# EAGLE schematic EDCPSUMK2_2040 (EAGLE 9.6.2)
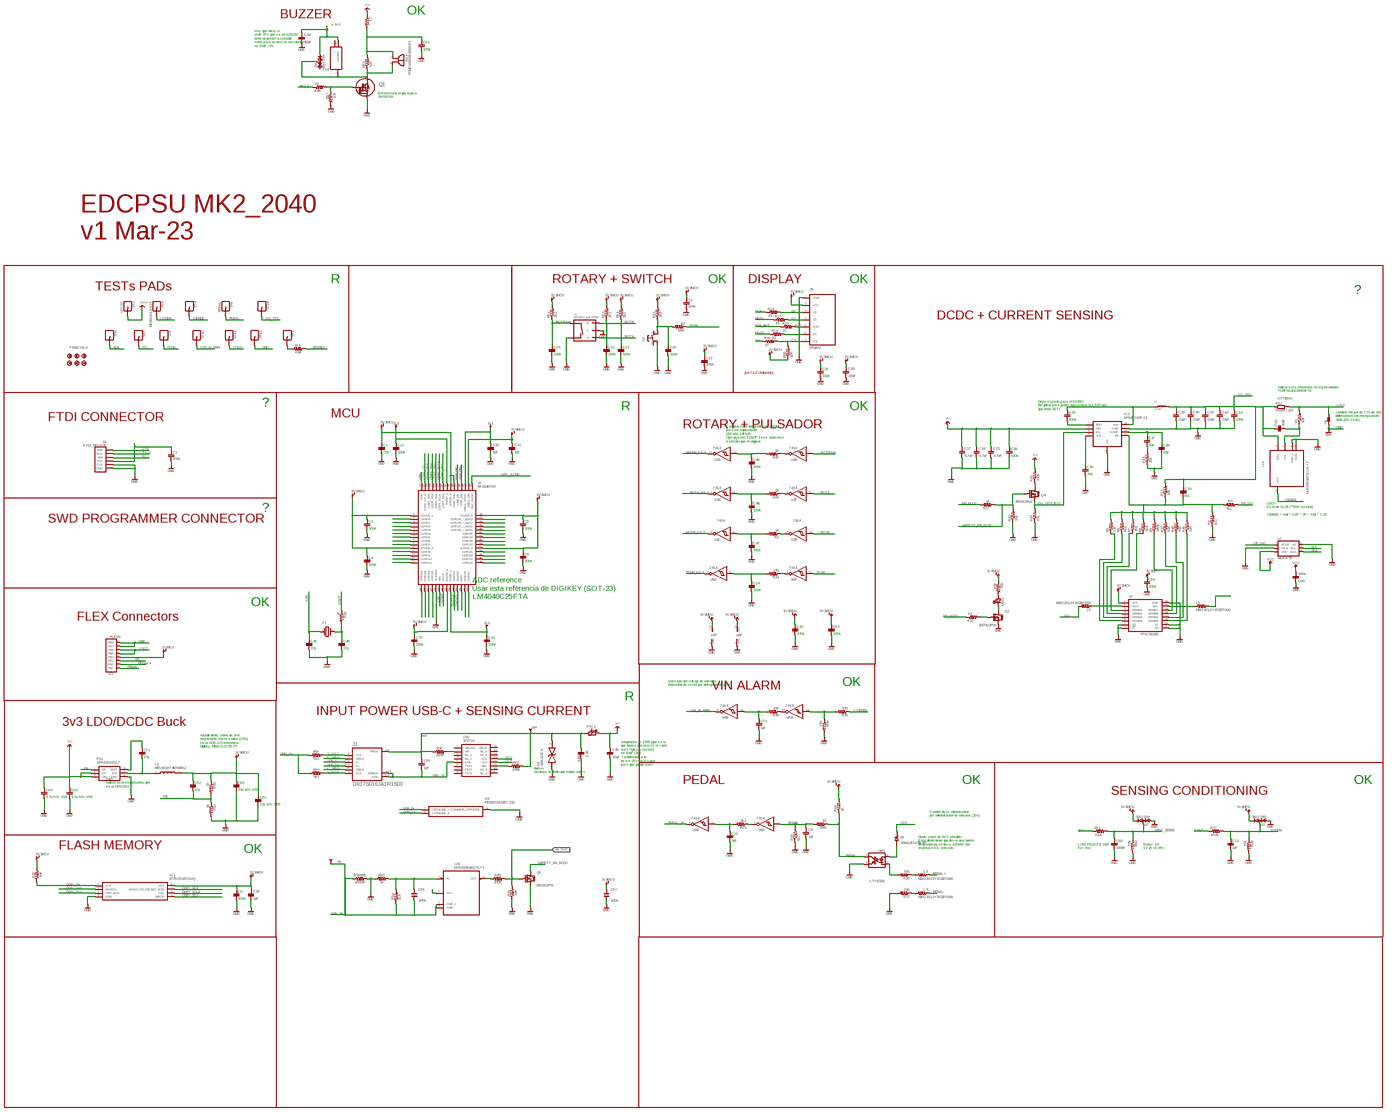
[diagram p0: schematic, sheet 1, overview]
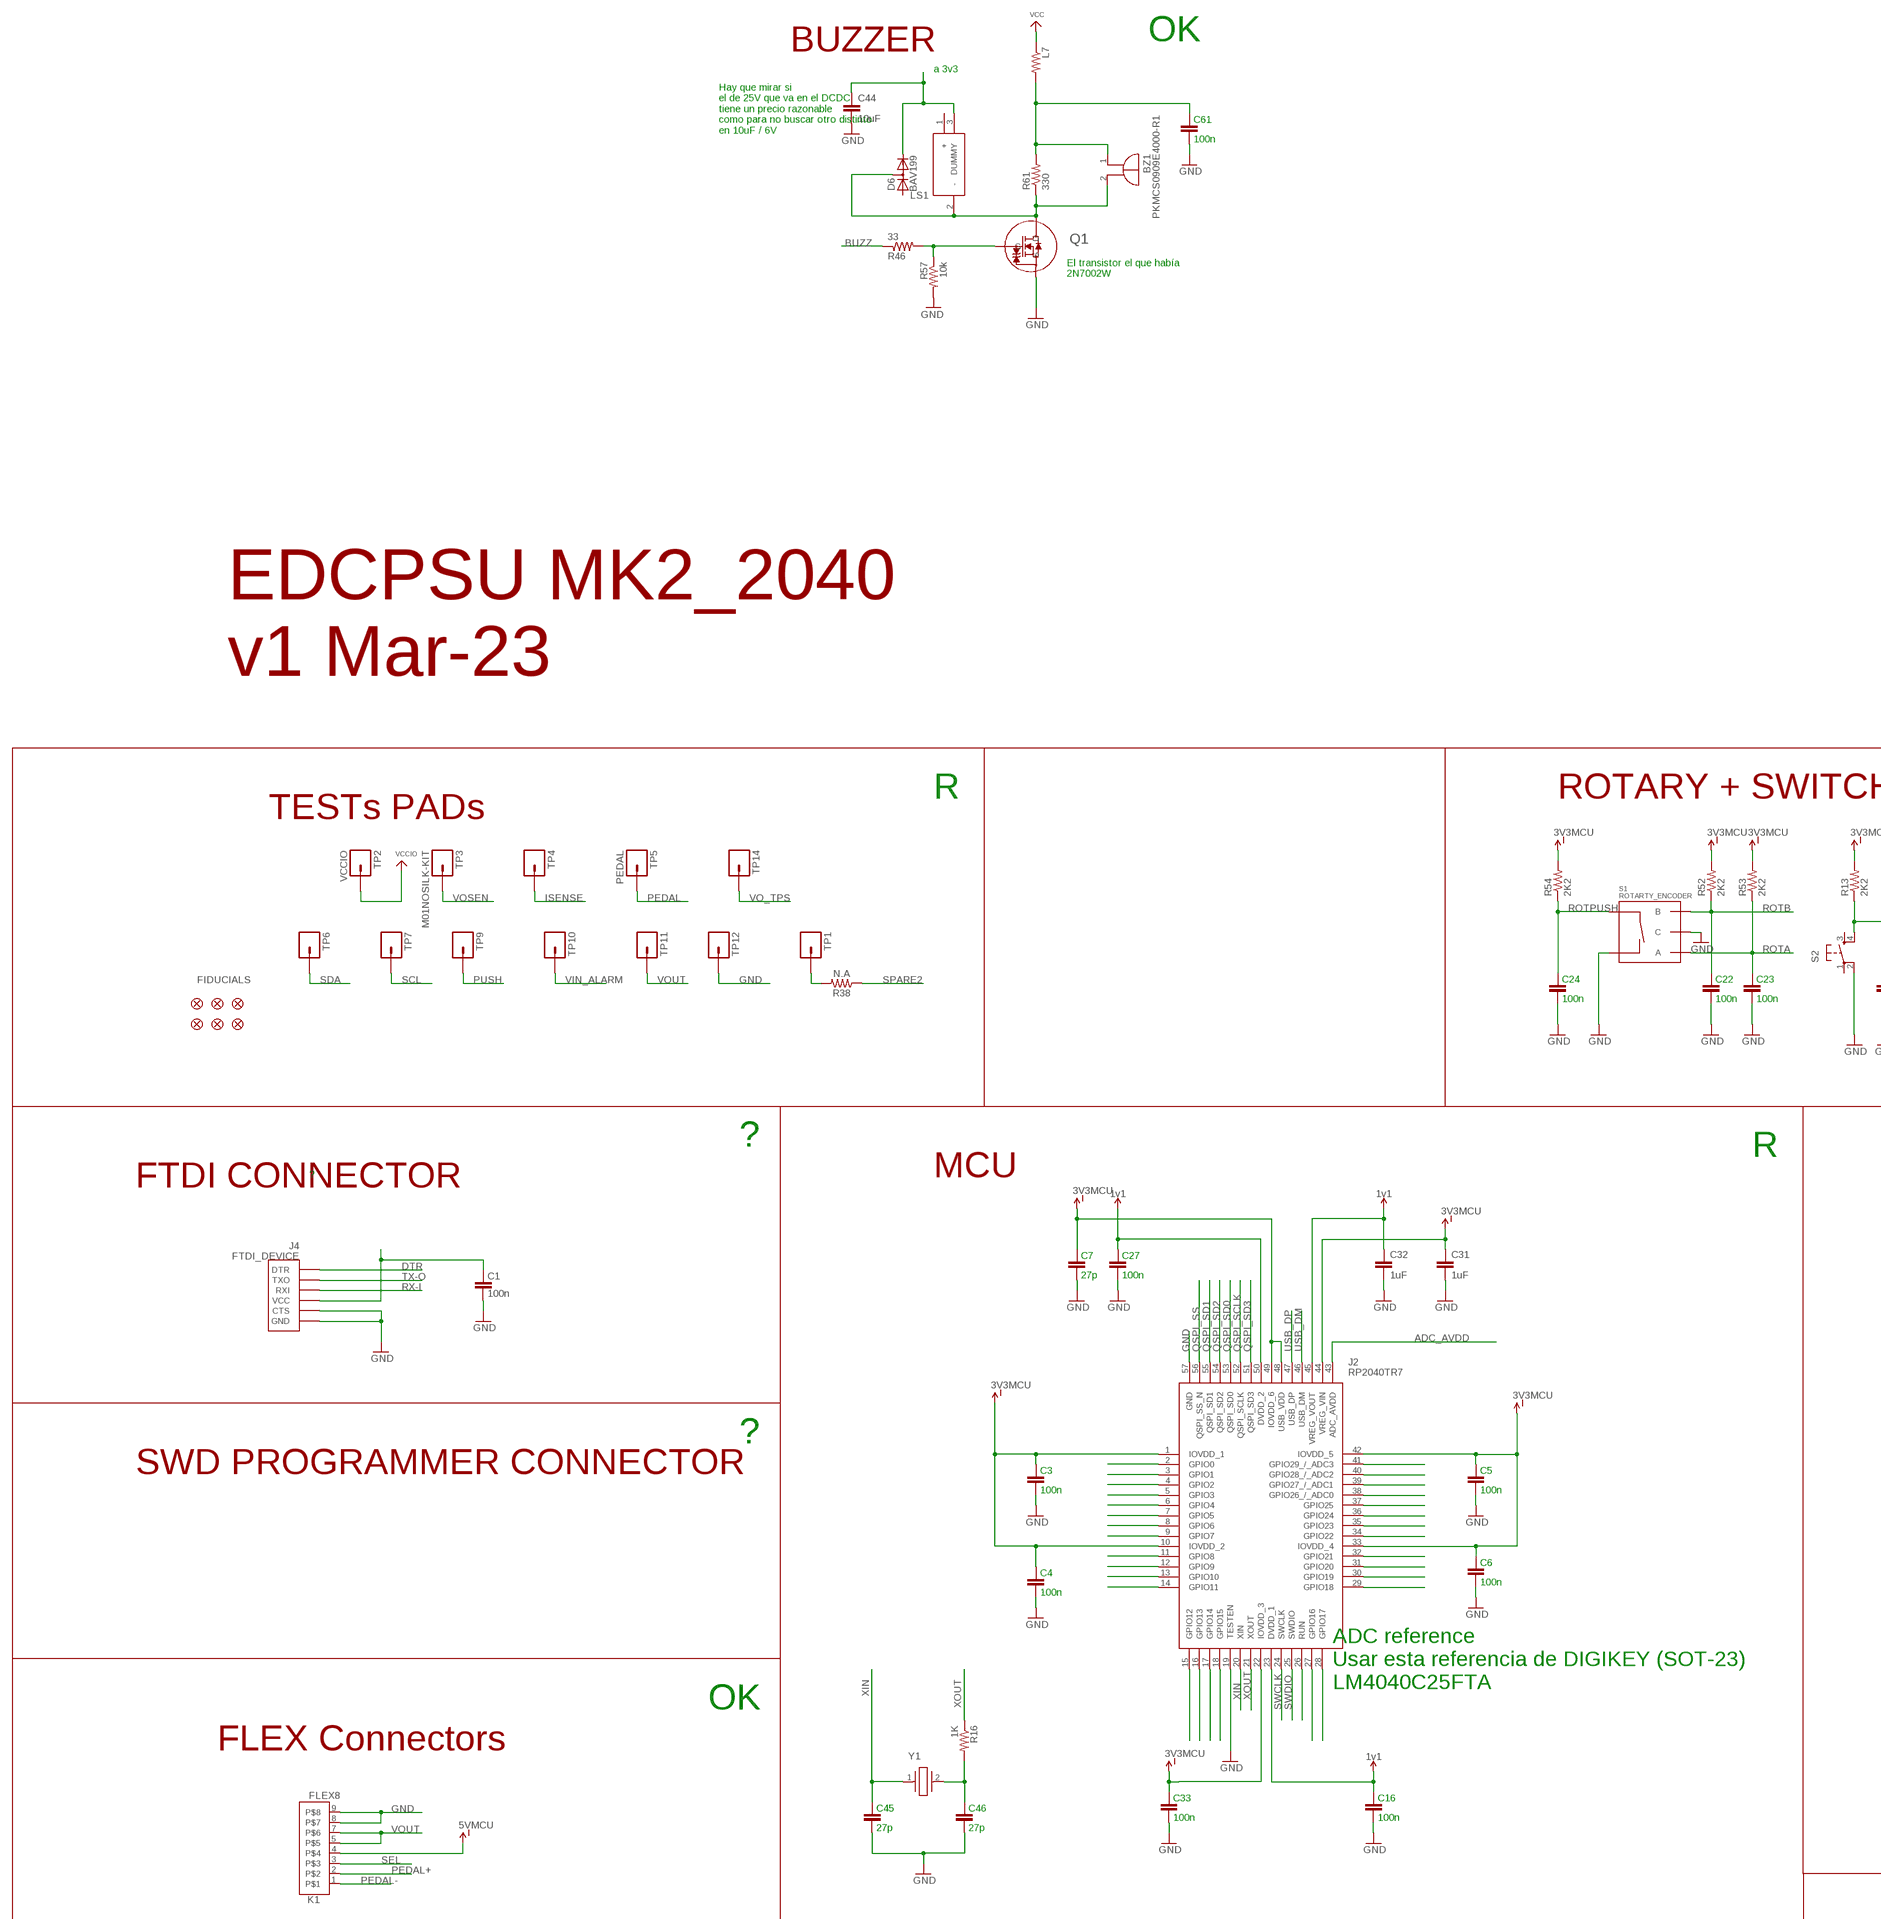
[diagram p1: schematic, sheet 1, part 1 of 4]
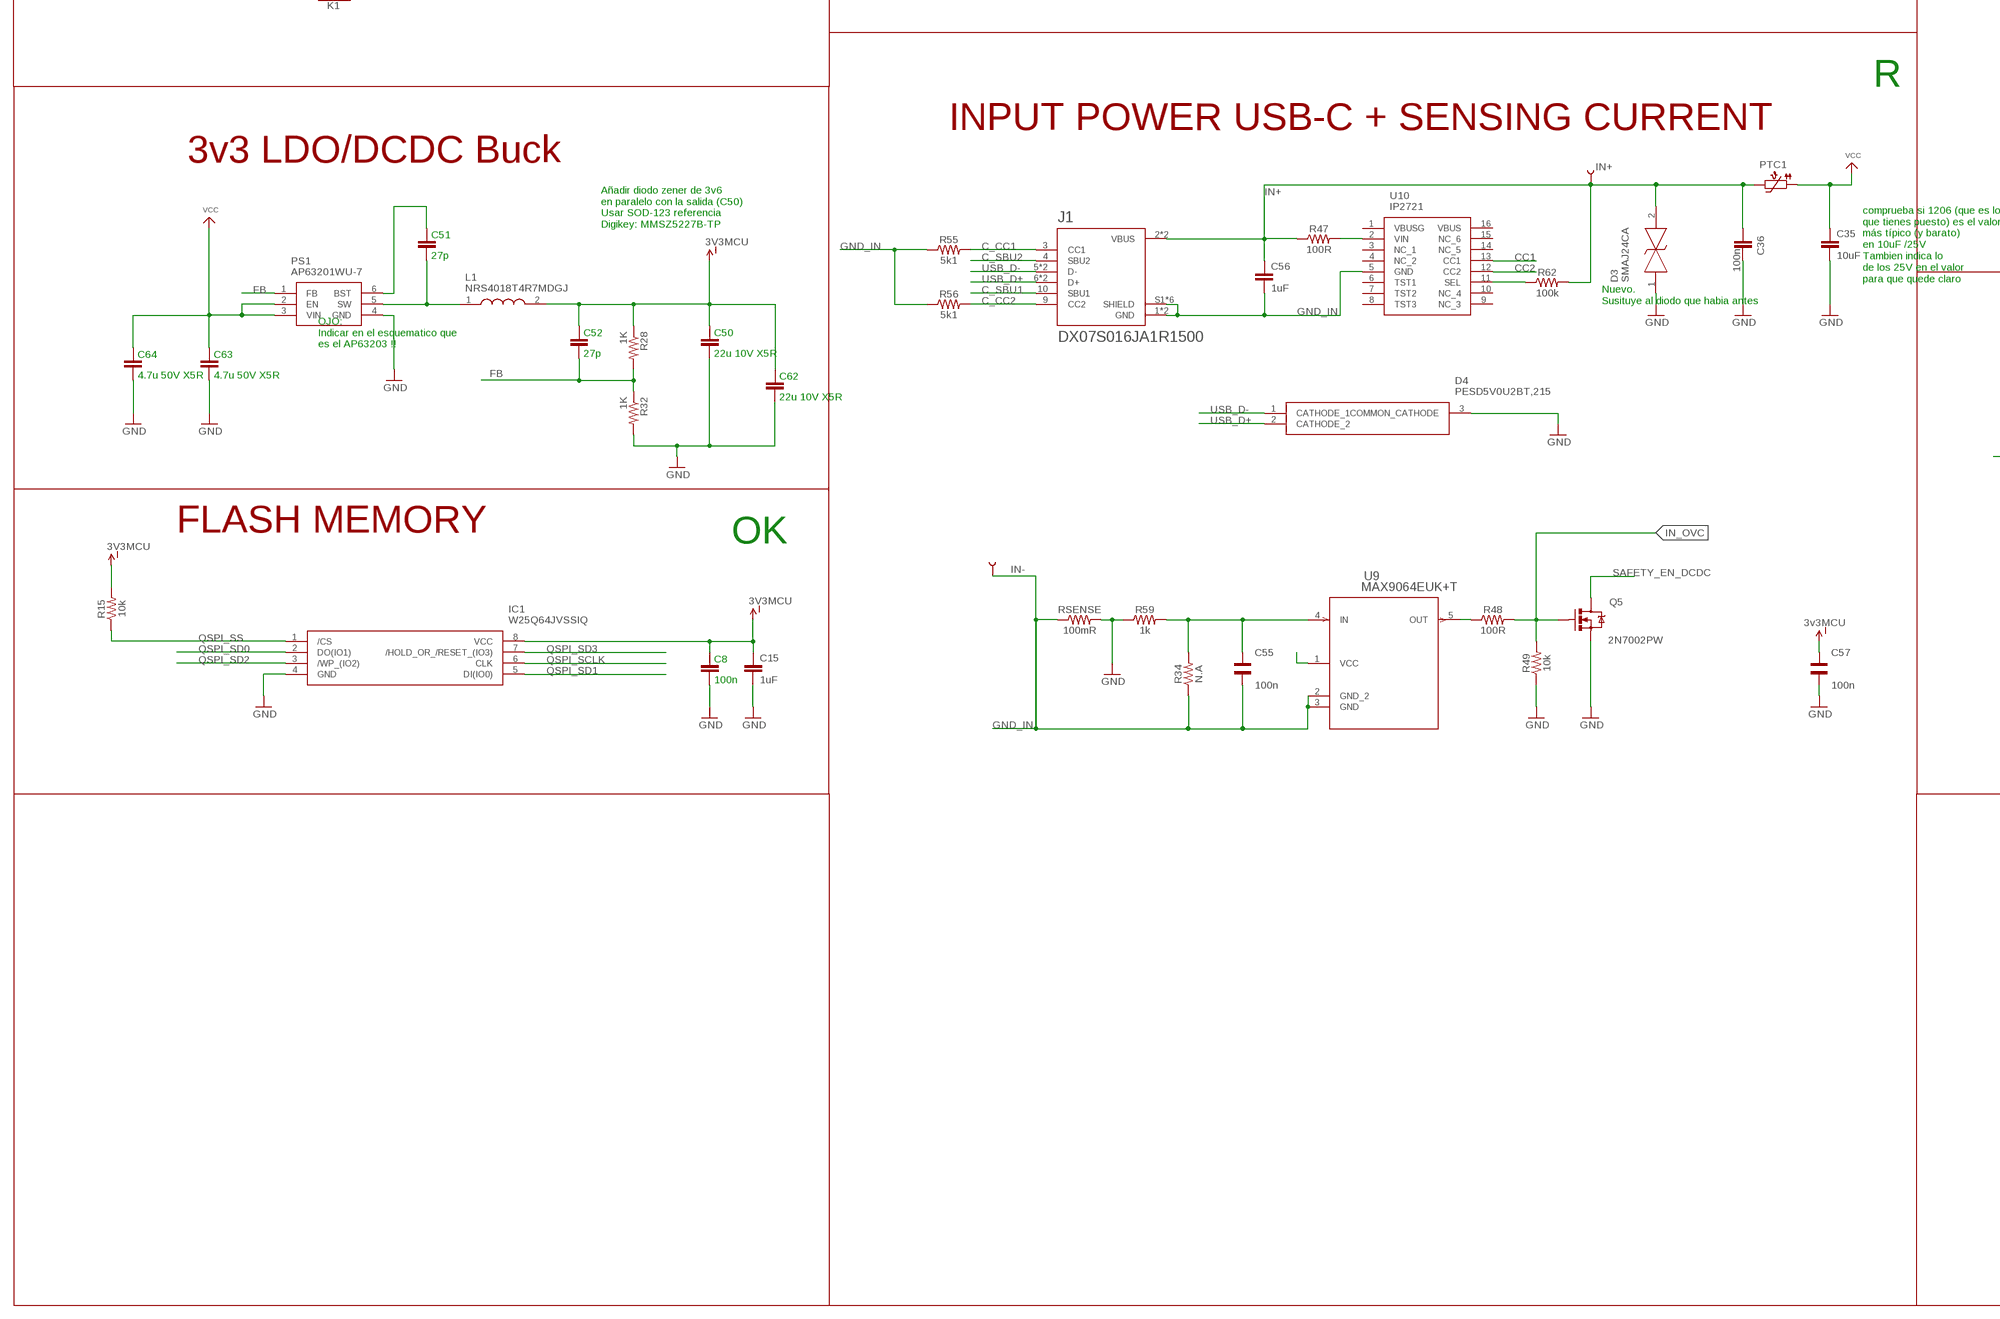
[diagram p2: schematic, sheet 1, part 2 of 4]
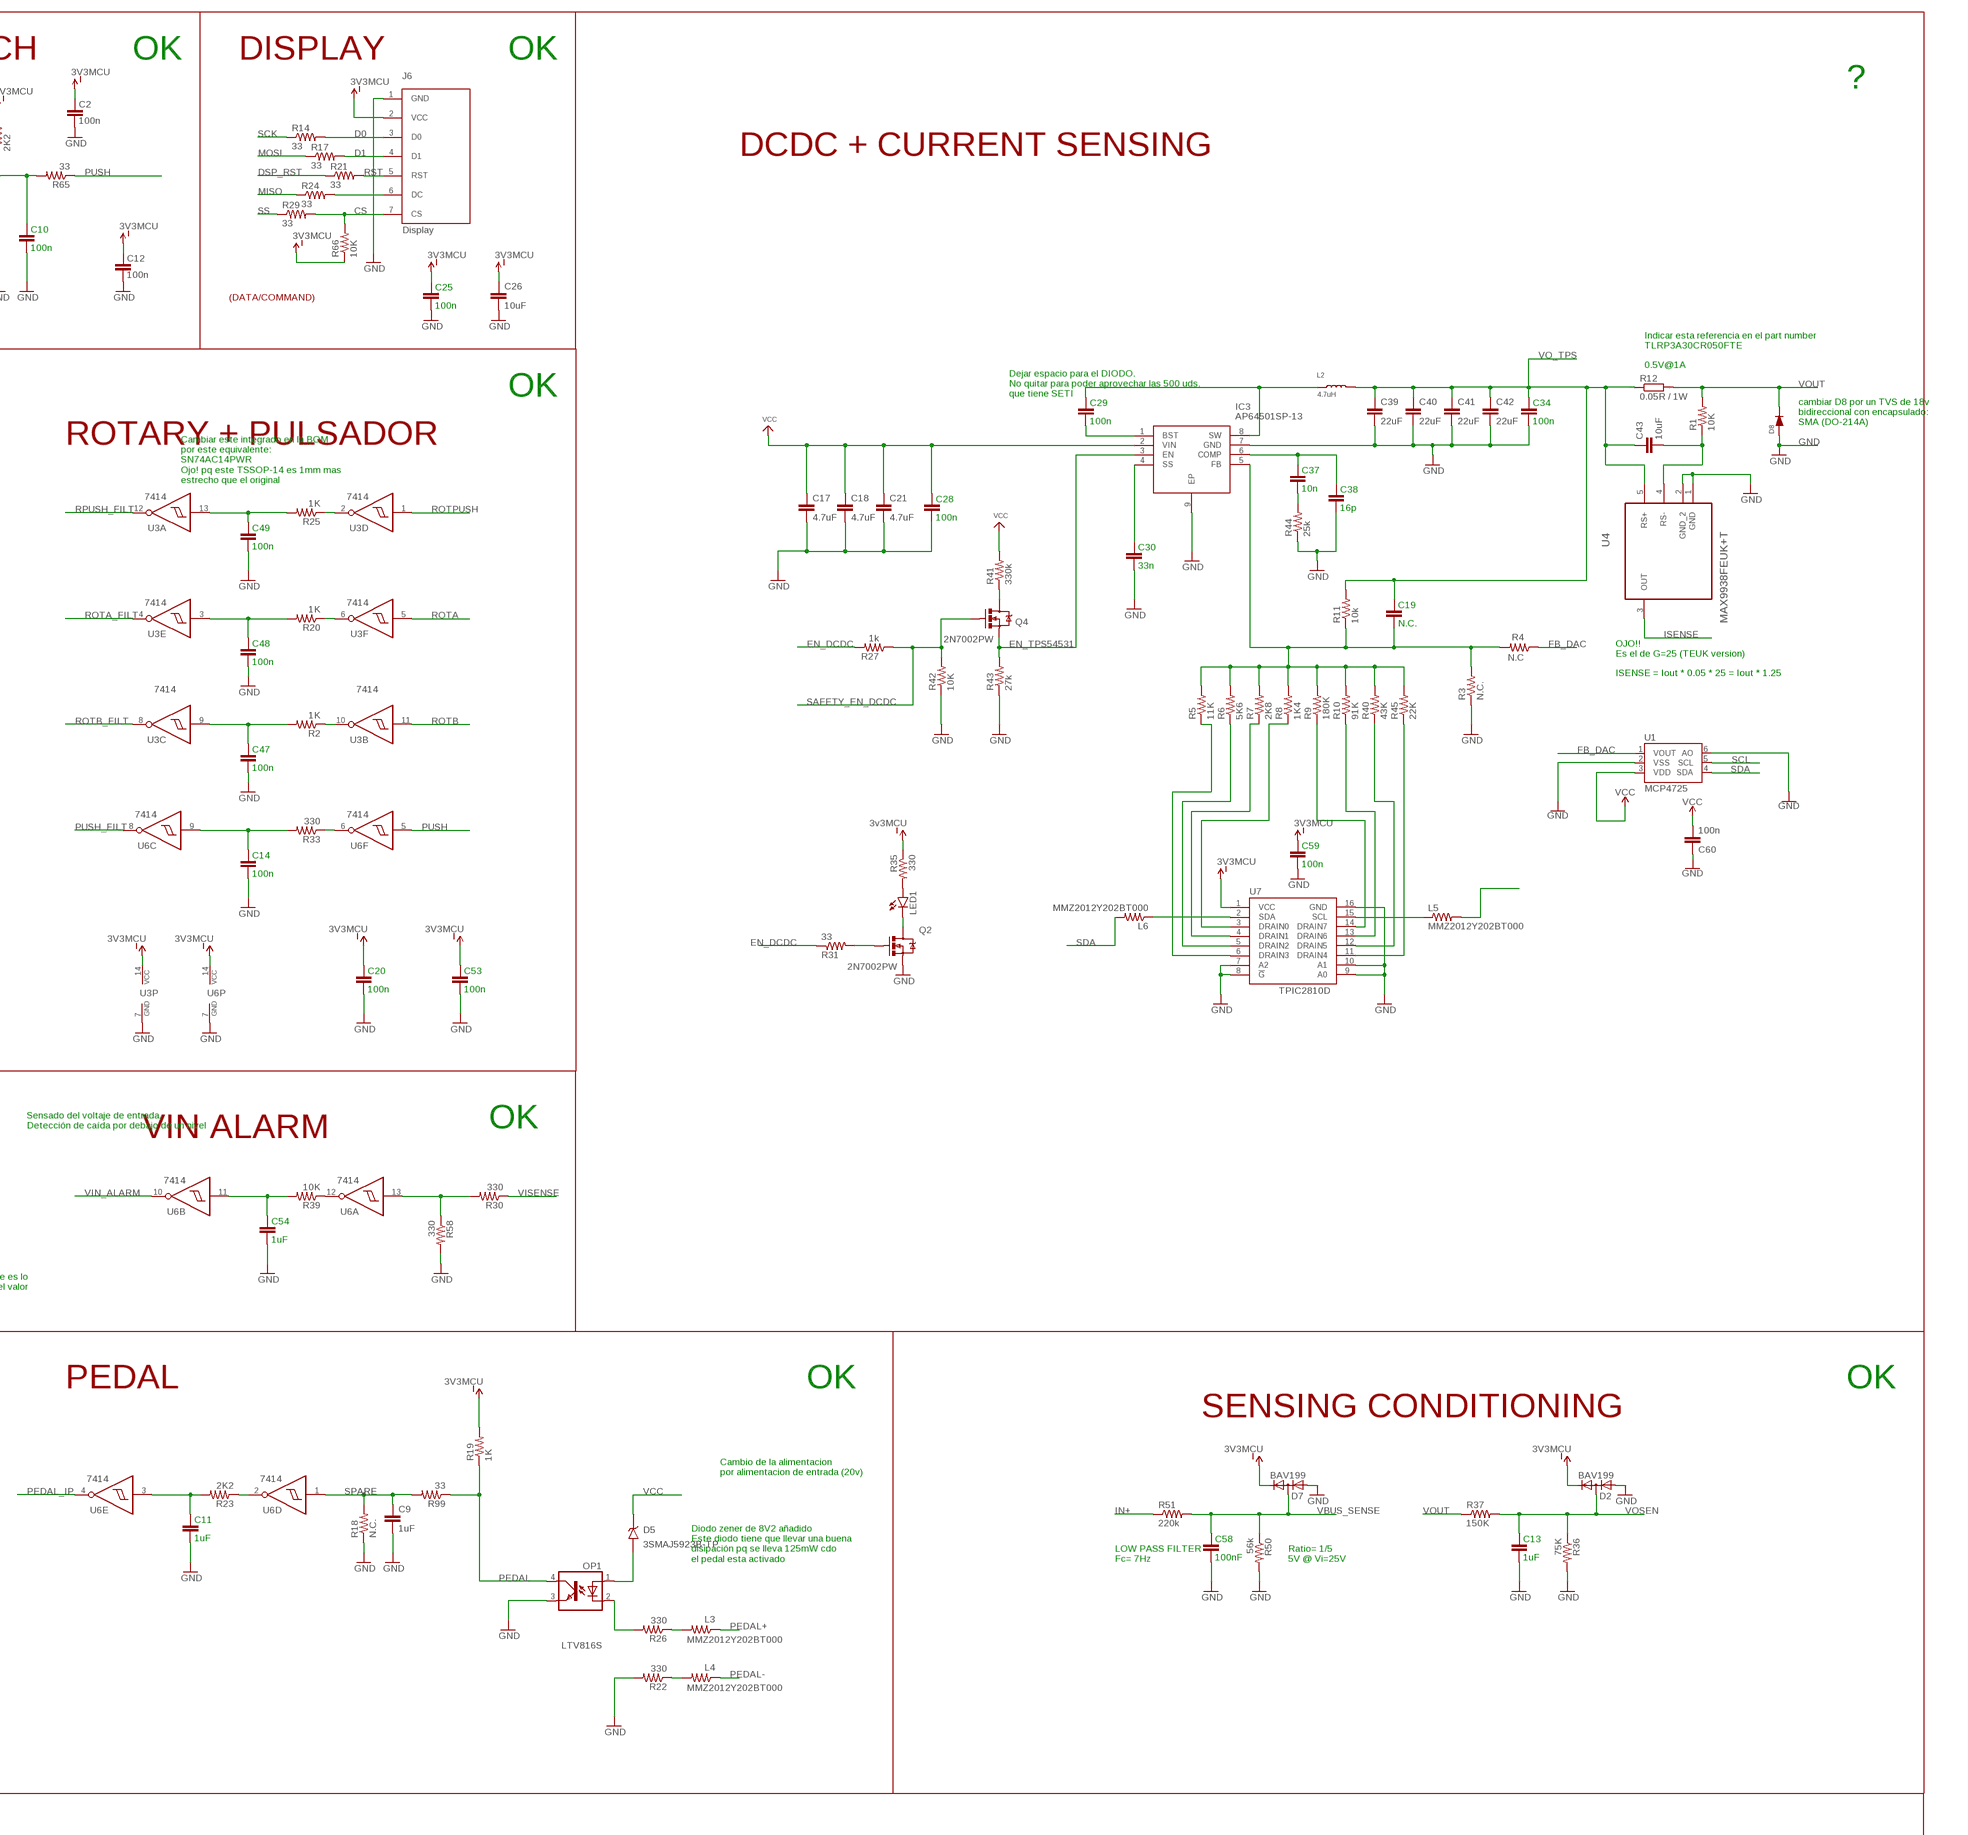
[diagram p3: schematic, sheet 1, part 3 of 4]
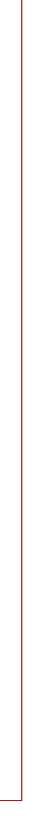
[diagram p4: schematic, sheet 1, part 4 of 4]

## Parts
BZ1  PKMCS0909E4000-R1  [PKMCS0909]
C1  100n  CAP0805  [0805]
C2  100n  CAP0805  [0805]
C3  100n  CAP0805  [0805]
C4  100n  CAP0805  [0805]
C5  100n  CAP0805  [0805]
C6  100n  CAP0805  [0805]
C7  27p  CAP0805  [0805]
C8  100n  CAP0805  [0805]
C9  1uF  CAP1206  [1206]
C10  100n  CAP0805  [0805]
C11  1uF  CAP0805  [0805]
C12  100n  CAP0805  [0805]
C13  1uF  CAP0805  [0805]
C14  100n  CAP0805  [0805]
C15  1uF  CAP1206  [1206]
C16  100n  CAP0805  [0805]
C17  4.7uF  CAP1210  [1210]
C18  4.7uF  CAP1210  [1210]
C19  N.C.  CAP0805  [0805]
C20  100n  CAP0805  [0805]
C21  4.7uF  CAP1210  [1210]
C22  100n  CAP0805  [0805]
C23  100n  CAP0805  [0805]
C24  100n  CAP0805  [0805]
C25  100n  CAP0805  [0805]
C26  10uF  CAP1206  [1206]
C27  100n  CAP0805  [0805]
C28  100n  CAP0805  [0805]
C29  100n  CAP0805  [0805]
C30  33n  CAP0805  [0805]
C31  1uF  CAP1206  [1206]
C32  1uF  CAP1206  [1206]
C33  100n  CAP0805  [0805]
C34  100n  CAP0805  [0805]
C35  10uF  CAP1206  [1206]
C36  100n  CAP0805  [0805]
C37  10n  CAP0805  [0805]
C38  16p  CAP0805  [0805]
C39  22uF  CAP1210  [1210]
C40  22uF  CAP1210  [1210]
C41  22uF  CAP1210  [1210]
C42  22uF  CAP1210  [1210]
C43  10uF  CAP1206  [1206]
C44  10uF  CAP1206  [1206]
C45  27p  CAP0805  [0805]
C46  27p  CAP0805  [0805]
C47  100n  CAP0805  [0805]
C48  100n  CAP0805  [0805]
C49  100n  CAP0805  [0805]
C50  22u 10V X5R  CAP0805  [0805]
C51  27p  CAP0805  [0805]
C52  27p  CAP0805  [0805]
C53  100n  CAP0805  [0805]
C54  1uF  CAP0805  [0805]
C55  100n  WCAP-CSGP_1206_885012008001  [WCAP-CSGP_1206]
C56  1uF  CAP1206  [1206]
C57  100n  WCAP-CSGP_1206_885012008001  [WCAP-CSGP_1206]
C58  100nF  CAP0805  [0805]
C59  100n  CAP0805  [0805]
C60  100n  C-EUC0805  [C0805]
C61  100n  CAP0805  [0805]
C62  22u 10V X5R  CAP0805  [0805]
C63  4.7u 50V X5R  CAP0805  [0805]
C64  4.7u 50V X5R  CAP0805  [0805]
D2  BAV199  [SOT23]
D3  SMAJ24CA  [DIONM5127X229N]
D4  PESD5V0U2BT,215  [SOT95P230X110-3N]
D5  3SMAJ5923B-TP  [DIOM4325X244N]
D6  BAV199  [SOT23]
D7  BAV199  [SOT23]
D8  RB060M-60TR  DSMA  [SMADIODE]
FID1  FIDUCIAL1X2  [FIDUCIAL-1X2]
FID2  FIDUCIAL1X2  [FIDUCIAL-1X2]
FID3  FIDUCIAL1X2  [FIDUCIAL-1X2]
FID4  FIDUCIAL1X2  [FIDUCIAL-1X2]
FID5  FIDUCIAL1X2  [FIDUCIAL-1X2]
FID6  FIDUCIAL1X2  [FIDUCIAL-1X2]
IC1  W25Q64JVSSIQ  [SOIC127P790X216-8N]
IC3  AP64501SP-13  [SOIC127P600X163-9N]
IN+  TEST-POINT3  [PAD.03X.03]
IN-  TEST-POINT3  [PAD.03X.03]
J1  DX07S016JA1R1500  [JAE_DX07S016JA1R1500]
J2  RP2040TR7  [RP2040TR7]
J4  FTDI_DEVICE  [FTDI_DEVICE_SIDE]
J6  Display  OLED_LCD  [OLED_LCD]
K1  FLEX8  [FLEX8]
L1  NRS4018T4R7MDGJ  [NRS4018T100MDGJ]
L2  4.7uH  L74437368047  [WE-LHMI]
L3  MMZ2012Y202BT000  RESISTOR0805-RES  [0805]
L4  MMZ2012Y202BT000  RESISTOR0805-RES  [0805]
L5  MMZ2012Y202BT000  RESISTOR0805-RES  [0805]
L6  MMZ2012Y202BT000  RESISTOR0805-RES  [0805]
L7  MMZ2012Y202BT000  RESISTOR0805-RES  [0805]
LED1  LED3MM  [LED3MM]
LS1  SMT-0540-S-R  [SMT0540SR]
OP1  LTV816S  [SMD4]
PS1  AP63201WU-7  [SOT95P280X100-6N]
PTC1  2A NOM / 3.5A LIM  PTC-  [1812L]
Q1  PJA3416AE_R1_00001  [SOT23_PJA3416_PNJ]
Q2  2N7002PW  MOSFET-NCHANNEL2N7002PW  [SOT323]
Q4  2N7002PW  MOSFET-NCHANNEL2N7002PW  [SOT323]
Q5  2N7002PW  MOSFET-NCHANNEL2N7002PW  [SOT323]
R1  10K  RESISTOR0805-RES  [0805]
R2  1K  RESISTOR0805-RES  [0805]
R3  N.C.  RESISTOR0805-RES  [0805]
R4  N.C  RESISTOR0805-RES  [0805]
R5  11K  RESISTOR0805-RES  [0805]
R6  5K6  RESISTOR0805-RES  [0805]
R7  2K8  RESISTOR0805-RES  [0805]
R8  1K4  RESISTOR0805-RES  [0805]
R9  180K  RESISTOR0805-RES  [0805]
R10  91K  RESISTOR0805-RES  [0805]
R11  10k  RESISTOR0805-RES  [0805]
R12  0.05R / 1W  RR2512  [R2512]
R13  2K2  RESISTOR0805-RES  [0805]
R14  33  RESISTOR0805-RES  [0805]
R15  10k  RESISTOR0603  [0603]
R16  1K  RESISTOR0805-RES  [0805]
R17  33  RESISTOR0805-RES  [0805]
R18  N.C.  RESISTOR0805-RES  [0805]
R19  1K  RESISTOR0805-RES  [0805]
R20  1K  RESISTOR0805-RES  [0805]
R21  33  RESISTOR0805-RES  [0805]
R22  330  RESISTOR1206  [1206]
R23  2K2  RESISTOR0805-RES  [0805]
R24  33  RESISTOR0805-RES  [0805]
R25  1K  RESISTOR0805-RES  [0805]
R26  330  RESISTOR1206  [1206]
R27  1k  RESISTOR0805-RES  [0805]
R28  1K  RESISTOR0805-RES  [0805]
R29  33  RESISTOR0805-RES  [0805]
R30  330  RESISTOR0805-RES  [0805]
R31  33  RESISTOR0805-RES  [0805]
R32  1K  RESISTOR0805-RES  [0805]
R33  330  RESISTOR0805-RES  [0805]
R34  N.A  RESISTOR0603  [0603]
R35  330  RESISTOR0805-RES  [0805]
R36  75K  RESISTOR0805-RES  [0805]
R37  150K  RESISTOR0805-RES  [0805]
R38  N.A  RESISTOR0603  [0603]
R39  10K  RESISTOR0805-RES  [0805]
R40  43K  RESISTOR0805-RES  [0805]
R41  330k  RESISTOR0805-RES  [0805]
R42  10K  RESISTOR0805-RES  [0805]
R43  27k  RESISTOR0805-RES  [0805]
R44  25k  RESISTOR0805-RES  [0805]
R45  22K  RESISTOR0805-RES  [0805]
R46  33  RESISTOR0805-RES  [0805]
R47  100R  RESISTOR0603  [0603]
R48  100R  RESISTOR0603  [0603]
R49  10k  RESISTOR0603  [0603]
R50  56k  RESISTOR0603  [0603]
R51  220k  RESISTOR0603  [0603]
R52  2K2  RESISTOR0805-RES  [0805]
R53  2K2  RESISTOR0805-RES  [0805]
R54  2K2  RESISTOR0805-RES  [0805]
R55  5k1  RESISTOR0603  [0603]
R56  5k1  RESISTOR0603  [0603]
R57  10k  RESISTOR0805-RES  [0805]
R58  330  RESISTOR0805-RES  [0805]
R59  1k  RESISTOR0603  [0603]
R61  330  RESISTOR0805-RES  [0805]
R62  100k  RESISTOR0603  [0603]
R65  33  RESISTOR0805-RES  [0805]
R66  10K  RESISTOR0805-RES  [0805]
R99  33  RESISTOR0805-RES  [0805]
RSENSE  100mR  RESISTOR1206  [1206]
S1  ROTARTY_ENCODER  [ROTARY_ENC_PLAIN]
S2  TAC_SWITCH_KSC931G-SMD  [TAC_SW_SMD_KSC931G]
TP1  M01POGOPIN_HOLE_LARGE  [1X01_POGOPIN_HOLE_LARGE]
TP2  VCCIO  M01POGOPIN_HOLE_LARGE  [1X01_POGOPIN_HOLE_LARGE]
TP3  M01NOSILK-KIT  [1X01NS-KIT]
TP4  M01POGOPIN_HOLE_LARGE  [1X01_POGOPIN_HOLE_LARGE]
TP5  PEDAL  M01POGOPIN_HOLE_LARGE  [1X01_POGOPIN_HOLE_LARGE]
TP6  M01POGOPIN_HOLE_LARGE  [1X01_POGOPIN_HOLE_LARGE]
TP7  M01POGOPIN_HOLE_LARGE  [1X01_POGOPIN_HOLE_LARGE]
TP9  M01POGOPIN_HOLE_LARGE  [1X01_POGOPIN_HOLE_LARGE]
TP10  M01POGOPIN_HOLE_LARGE  [1X01_POGOPIN_HOLE_LARGE]
TP11  M01POGOPIN_HOLE_LARGE  [1X01_POGOPIN_HOLE_LARGE]
TP12  M01POGOPIN_HOLE_LARGE  [1X01_POGOPIN_HOLE_LARGE]
TP14  M01POGOPIN_HOLE_LARGE  [1X01_POGOPIN_HOLE_LARGE]
U1  MCP4725  MCP4725SOT-23  [SOT23-6]
U3  7414  [TSSOP14]
U4  MAX9938FEUK+T  [SOT95P280X145-5N]
U6  7414  [TSSOP14]
U7  TPIC2810D  [SO16]
U9  MAX9064EUK+T  [21-0057F_MXM]
U10  IP2721  [SOP65P640X120-16N]
Y1  ABLS-12.000MHZ-B4-T  [ABLS]

## Nets
ADC_AVDD: J2.43(ADC_AVDD)
BUZZ: R46.1
C_CC1: J1.3(CC1) R55.2
C_CC2: J1.9(CC2) R56.2
C_SBU1: J1.10(SBU1)
C_SBU2: J1.4(SBU2)
CC1: U10.13(CC1)
CC2: U10.12(CC2)
CS: J6.7(CS) R29.2 R66.2
D0: J6.3(D0) R14.2
D1: J6.4(D1) R17.2
DSP_RST: R21.1
DTR: J4.P$1(DTR)
EN_DCDC: R27.2 R31.1
EN_TPS54531: IC3.3(EN) Q4.2(S) R43.2
FB: C52.1 PS1.1(FB) R28.2 R32.1
FB_DAC: R4.1 U1.1(VOUT)
GND: C1.1 C2.1 C3.1 C4.1 C5.1 C6.1 C7.1 C8.1 C9.2 C10.1 C11.1 C12.1 C13.1 C14.1 C15.2 C16.1 C17.2 C18.2 C20.1 C21.2 C22.1 C23.1 C24.1 C25.1 C26.2 C27.1 C28.1 C30.1 C31.2 C32.2 C33.1 C34.1 C35.2 C36.1 C38.1 C39.2 C40.2 C41.2 C42.2 C44.2 C45.1 C46.1 C47.1 C48.1 C49.1 C50.1 C53.1 C54.1 C57.1 C58.1 C59.1 C60.1 C61.1 C62.1 C63.1 C64.1 D2.1(A) D3.1 D4.3(COMMON_CATHODE) D7.1(A) D8.A IC1.4(GND) IC3.7(GND) IC3.9(EP) J2.19(TESTEN) J2.57(GND) J4.P$5(CTS) J4.P$6(GND) J6.1(GND) K1.8 K1.9 OP1.3(EMIT) PS1.4(GND) Q1.2(S) Q2.2(S) Q5.2(S) R3.1 R18.1 R22.2 R32.2 R36.2 R42.1 R43.1 R44.1 R49.1 R50.2 R57.2 R58.2 R59.1 RSENSE.2 S1.C S1.SW- S2.2 TP12.1 U1.2(VSS) U1.6(AO) U3.7(P:GND) U4.1(GND) U4.2(GND_2) U6.7(P:GND) U7.7(A2) U7.8(!G) U7.9(A0) U7.10(A1) U7.16(GND)
GND_IN: C55.1 C56.2 IN-.P$1 J1.1(GND) J1.12(GND) J1.S1(SHIELD) J1.S2(SHIELD) J1.S3(SHIELD) J1.S4(SHIELD) J1.S5(SHIELD) J1.S6(SHIELD) R34.1 R55.1 R56.1 RSENSE.1 U9.2(GND_2) U9.3(GND) U10.5(GND)
IN+: C36.2 C56.1 D3.2 IN+.P$1 J1.2(VBUS) J1.11(VBUS) PTC1.2 R47.1 R51.1 R62.2
IN_OVC: Q5.1(G) R48.2 R49.2
ISENSE: TP4.1 U4.3(OUT)
MISO: R24.1
MOSI: R17.1
N$1: R5.1 U7.6(DRAIN3)
N$2: R6.1 U7.5(DRAIN2)
N$3: C44.1 D6.2(C) LS1.3(DUMMY)
N$4: R7.1 U7.4(DRAIN1)
N$5: R8.1 U7.3(DRAIN0)
N$6: J6.6(DC) R24.2
N$7: R9.1 U7.14(DRAIN7)
N$8: R10.1 U7.13(DRAIN6)
N$9: R40.1 U7.12(DRAIN5)
N$10: C43.2 R1.1 U4.4(RS-)
N$11: LED1.A R35.2
N$12: LED1.K(C) Q2.3(D)
N$13: R33.1 U6.6(F:O)
N$14: R30.2 R58.1 U6.13(A:I)
N$15: R39.1 U6.12(A:O)
N$16: R45.1 U7.11(DRAIN4)
N$17: C10.2 R13.1 R65.2 S2.4
N$18: C47.2 R2.2 U3.9(C:I)
N$19: D5.A OP1.1(A)
N$21: Q2.1(G) R31.2
N$22: R2.1 U3.10(B:O)
N$23: R20.1 U3.6(F:O)
N$24: J2.37(GPIO25)
N$25: R25.1 U3.2(D:O)
N$26: C49.2 R25.2 U3.13(A:I)
N$27: U9.1(VCC)
N$28: C48.2 R20.2 U3.3(E:I)
N$29: C11.2 R23.2 U6.3(E:I)
N$30: C1.2 J4.P$4(VCC)
N$31: J2.41(GPIO29_/_ADC3)
N$32: J2.40(GPIO28_/_ADC2)
N$33: J2.39(GPIO27_/_ADC1)
N$34: R23.1 U6.2(D:O)
N$35: Q4.3(D) R41.1
N$36: J2.38(GPIO26_/_ADC0)
N$37: C14.2 R33.2 U6.9(C:I)
N$38: R38.2 TP1.1
N$39: C54.2 R39.2 U6.11(B:I)
N$40: L6.1 U7.2(SDA)
N$41: OP1.2(C) R26.2
N$42: J2.36(GPIO24)
N$43: L3.2 R26.1
N$44: C30.2 IC3.4(SS)
N$45: R62.1 U10.11(SEL)
N$46: L4.2 R22.1
N$47: C29.1 IC3.1(BST)
N$48: C19.1 IC3.5(FB) R3.2 R4.2 R5.2 R6.2 R7.2 R8.2 R9.2 R10.2 R11.1 R40.2 R45.2
N$49: J2.35(GPIO23)
N$50: R47.2 U10.2(VIN)
N$51: C29.2 IC3.8(SW) L2.1
N$52: C37.2 C38.2 IC3.6(COMP)
N$53: C37.1 R44.2
N$54: L5.1 U7.15(SCL)
N$55: J2.34(GPIO22)
N$56: C51.2 PS1.6(BST)
N$57: J2.32(GPIO21)
N$58: R48.1 U9.5(OUT)
N$59: C55.2 R34.2 R59.2 U9.4(IN)
N$60: J2.31(GPIO20)
N$61: J2.30(GPIO19)
N$62: J2.29(GPIO18)
N$63: C46.2 R16.2 Y1.2
N$65: Q1.1(G) R46.2 R57.1
N$66: BZ1.2(-) D6.3(AC) LS1.2(-) Q1.3(D) R61.1
N$67: C51.1 L1.1 PS1.5(SW)
N$68: BZ1.1(+) C61.2 L7.2 R61.2
N$72: J2.2(GPIO0)
N$73: J2.3(GPIO1)
N$74: J2.4(GPIO2)
N$75: J2.5(GPIO3)
N$76: J2.6(GPIO4)
N$77: J2.7(GPIO5)
N$78: J2.8(GPIO6)
N$79: J2.9(GPIO7)
N$80: J2.11(GPIO8)
N$81: J2.12(GPIO9)
N$82: J2.13(GPIO10)
N$83: J2.14(GPIO11)
N$84: J2.15(GPIO12)
N$85: J2.16(GPIO13)
N$86: J2.17(GPIO14)
N$87: J2.18(GPIO15)
N$88: J2.28(GPIO17)
N$89: J2.27(GPIO16)
N$100: J2.26(RUN)
PEDAL: OP1.4(COL) R19.1 R99.1 TP5.1
PEDAL+: K1.2 L3.1
PEDAL-: K1.1 L4.1
PEDAL_IP: U6.4(E:O)
PUSH: R65.1 TP9.1 U6.5(F:I)
PUSH_FILT: U6.8(C:O)
QSPI_SCLK: IC1.6(CLK) J2.52(QSPI_SCLK)
QSPI_SD0: IC1.2(DO(IO1)) J2.53(QSPI_SD0)
QSPI_SD1: IC1.5(DI(IO0)) J2.55(QSPI_SD1)
QSPI_SD2: IC1.3(/WP_(IO2)) J2.54(QSPI_SD2)
QSPI_SD3: IC1.7(/HOLD_OR_/RESET_(IO3)) J2.51(QSPI_SD3)
QSPI_SS: IC1.1(/CS) J2.56(QSPI_SS_N) R15.1
ROTA: C23.2 R53.1 S1.A U3.5(F:I)
ROTA_FILT: U3.4(E:O)
ROTB: C22.2 R52.1 S1.B U3.11(B:I)
ROTB_FILT: U3.8(C:O)
ROTPUSH: C24.2 R54.1 S1.SW+ U3.1(D:I)
RPUSH_FILT: U3.12(A:O)
RST: J6.5(RST) R21.2
RX-I: J4.P$3(RXI)
SAFETY_EN_DCDC: Q4.1(G) Q5.3(D) R27.1 R42.2
SCK: R14.1
SCL: TP7.1 U1.5(SCL)
SCL1: L5.2
SDA: L6.2 TP6.1 U1.4(SDA)
SEL: K1.3
SPARE: C9.1 R18.2 R99.2 U6.1(D:I)
SPARE2: R38.1
SS: R29.1
SWCLK: J2.24(SWCLK)
SWDIO: J2.25(SWDIO)
TX-O: J4.P$2(TXO)
USB_D+: D4.2(CATHODE_2) J1.6(D+) J1.7(D+)
USB_D-: D4.1(CATHODE_1) J1.5(D-) J1.8(D-)
USB_DM: J2.46(USB_DM)
USB_DP: J2.47(USB_DP)
VBUS_SENSE: C58.2 D7.3(AC) R50.1 R51.2
VCC: C17.1 C18.1 C21.1 C28.2 C35.1 C60.2 C63.2 C64.2 D5.C(K) IC3.2(VIN) L7.1 PS1.2(EN) PS1.3(VIN) PTC1.1 R41.2 U1.3(VDD)
VCC-ISO: C2.2 C3.2 C4.2 C5.2 C6.2 C7.2 C8.2 C12.2 C15.1 C20.2 C25.2 C26.1 C31.1 C33.2 C50.2 C52.2 C53.2 C57.2 C59.2 C62.2 D2.2(C) D7.2(C) IC1.8(VCC) J2.1(IOVDD_1) J2.10(IOVDD_2) J2.22(IOVDD_3) J2.33(IOVDD_4) J2.42(IOVDD_5) J2.44(VREG_VIN) J2.48(USB_VDD) J2.49(IOVDD_6) J6.2(VCC) K1.4 L1.2 R13.2 R15.2 R19.2 R28.1 R35.1 R52.2 R53.2 R54.2 R66.1 U3.14(P:VCC) U6.14(P:VCC) U7.1(VCC) ; supply symbol labelled 3V3MCU, 3v3MCU, 5VMCU
VCCA: C16.2 C27.2 C32.1 J2.23(DVDD_1) J2.45(VREG_VOUT) J2.50(DVDD_2) ; supply symbol labelled 1v1
VCCIO: TP2.1
VIN_ALARM: TP10.1 U6.10(B:O)
VISENSE: R30.1
VO_TPS: C19.2 C34.2 C39.1 C40.1 C41.1 C42.1 C43.1 L2.2 R11.2 R12.1 TP14.1 U4.5(RS+)
VOSEN: C13.2 D2.3(AC) R36.1 R37.2 TP3.1
VOUT: D8.C(K) K1.5 K1.7 R1.2 R12.2 R37.1 TP11.1
XIN: C45.2 J2.20(XIN) Y1.1
XOUT: J2.21(XOUT) R16.1
Unconnected: D6.1(A) LS1.1(+) S2.1 S2.3 U10.1(VBUSG) U10.3(NC_1) U10.4(NC_2) U10.6(TST1) U10.7(TST2) U10.8(TST3) U10.9(NC_3) U10.10(NC_4) U10.14(NC_5) U10.15(NC_6) U10.16(VBUS)

## Notes on the sheet
- BUZZER | OK
- a 3v3
- Hay que mirar si 
  el de 25V que va en el DCDC
  tiene un precio razonable
  como para no buscar otro distinto
  en 10uF / 6V
- El transistor el que había 
  2N7002W
- EDCPSU MK2_2040 
  v1 Mar-23
- R | ROTARY + SWITCH | OK | DISPLAY | OK
- TESTs PADs | ?
- DCDC + CURRENT SENSING
- FIDUCIALS
- (DATA/COMMAND)
- Indicar esta referencia en el part number
  TLRP3A30CR050FTE
- 0.5V@1A
- ? | R | OK
- Dejar espacio para el DIODO.
  No quitar para poder aprovechar las 500 uds.
  que tiene SETI
- ? | MCU
- FTDI CONNECTOR
- cambiar D8 por un TVS de 18v
  bidireccional con encapsulado:
  SMA (DO-214A)
- ROTARY + PULSADOR
- Cambiar este integrado en la BOM
  por este equivalente:
  SN74AC14PWR
  Ojo! pq este TSSOP-14 es 1mm mas
  estrecho que el original
- OJO!!
  Es el de G=25 (TEUK version)
- ?
- ISENSE = Iout * 0.05 * 25 = Iout * 1.25
- SWD PROGRAMMER CONNECTOR
- ADC reference
  Usar esta referencia de DIGIKEY (SOT-23)
  LM4040C25FTA
- OK
- FLEX Connectors
- Sensado del voltaje de entrada.
  Detección de caída por debajo de un nivel
- VIN ALARM | OK
- R
- INPUT POWER USB-C + SENSING CURRENT
- 3v3 LDO/DCDC Buck
- Añadir diodo zener de 3v6 
  en paralelo con la salida (C50)
  Usar SOD-123 referencia
  Digikey: MMSZ5227B-TP
- comprueba si 1206 (que es lo 
  que tienes puesto) es el valor 
  más típico (y barato) 
  en 10uF /25V
  Tambien indica lo 
  de los 25V en el valor 
  para que quede claro
- Nuevo.
  Susituye al diodo que habia antes
- PEDAL | OK | OK
- OJO:
  Indicar en el esquematico que 
  es el AP63203 !!
- SENSING CONDITIONING
- Cambio de la alimentacion 
  por alimentacion de entrada (20v)
- FLASH MEMORY
- Diodo zener de 8V2 añadido
  Este diodo tiene que llevar una buena
  disipación pq se lleva 125mW cdo
  el pedal esta activado
- LOW PASS FILTER
  Fc= 7Hz
- Ratio= 1/5
  5V @ Vi=25V
- OK

## Library data of the parts
BZ1 = buzzer:PKMCS0909E4000-R1: PKMCS0909E4000-R1 Source : http://www.murata.com/~/media/webrenewal/products/sound/sounder/vppt-buzj083-d.ashx
C1-C8 C10-C14 C16 C19 C20 C22-C25 C27-C30 C33 C34 C36-C38 C45-C54 C58 C59 C61-C64 = SparkFun:CAP: Capacitor Standard 0603 ceramic capacitor, and 0.1" leaded capacitor.
C9 C15 C17 C18 C21 C26 C31 C32 C35 C39-C44 C56 = SparkFun-Passives:CAP: Capacitor Standard 0603 ceramic capacitor, and 0.1" leaded capacitor.
C55 C57 = Wurth_Elektronik_Passive_Capacitors_rev19a:WCAP-CSGP_1206: WCAP-CSGP Ceramic Capacitors Characteristics Multilayer Ceramic Chip Capacitor Recommended soldering:Reflow, for 0603 and 0805 wave soldering is also allowed Operating temperature:-55 °C to +125 °C; Ceramic characteristics: Class I - NPO ; Class II -X7R, X5R High performance ceramic High capacitance stability Minimal aging Termination:Cu/Ni/Sn Details see: http://katalog.we-online.de/en/pbs/WCAP-CSGP-1206? Created: 2015-01-28 2015 (C) Wurth Elektronik
C60 = rcl:C-EU: CAPACITOR, European symbol; SPICEPREFIX: C
D2 D6 D7 = diode:BAV199: DIODE low-leakage double diode
D3 = SMAJ24CA:SMAJ24CA: ESD Suppressors / TVS Diodes 24volts 5uA 10.3 Amps Bi-Dir Source: Datasheet; ARROW_PART_NUMBER: SMAJ24CA; ARROW_PRICE-STOCK: https://www.arrow.com/en/products/smaj24ca/bourns?region=nac; DESCRIPTION: ESD Suppressors / TVS Diodes 24volts 5uA 10.3 Amps Bi-Dir; HEIGHT: 2.29mm; MANUFACTURER_NAME: Bourns; MANUFACTURER_PART_NUMBER: SMAJ24CA; MOUSER_PART_NUMBER: 652-SMAJ24CA; MOUSER_PRICE-STOCK: https://www.mouser.co.uk/ProductDetail/Bourns/SMAJ24CA?qs=A3H9pljuJ8RsSQb8zLkILA%3D%3D
D4 = PESD5V0U2BT_215:PESD5V0U2BT,215: PESD5V0U2BT - Ultra low capacitance bidirectional double ESD protection diode Source: Datasheet; ARROW_PART_NUMBER: PESD5V0U2BT,215; ARROW_PRICE-STOCK: https://www.arrow.com/en/products/pesd5v0u2bt215/nexperia?region=nac; DESCRIPTION: PESD5V0U2BT - Ultra low capacitance bidirectional double ESD protection diode; HEIGHT: 1.1mm; MANUFACTURER_NAME: Nexperia; MANUFACTURER_PART_NUMBER: PESD5V0U2BT,215; MOUSER_PART_NUMBER: 771-PESD5V0U2BTT/R; MOUSER_PRICE-STOCK: https://www.mouser.co.uk/ProductDetail/Nexperia/PESD5V0U2BT215?qs=LOCUfHb8d9uKnndgcTorSw%3D%3D
D5 = 3SMAJ5923B-TP:3SMAJ5923B-TP: Check availability; AVAILABILITY: In Stock; DESCRIPTION: Zener Diode 8.2 V 3 W ±5% Surface Mount DO-214AC (SMA); MF: Micro Commercial Components; MP: 3SMAJ5923B-TP; PACKAGE: DO-214 MCC; PRICE: None; PURCHASE-URL: https://pricing.snapeda.com/search/part/3SMAJ5923B-TP/?ref=eda
D8 = EDCPSU - Rev3:D*
FID1-FID6 = SparkFun-Aesthetics:FIDUCIAL: Fiducial Alignment Points Various fiducial points for machine vision alignment.
IC1 = W25Q64JVSSIQ:W25Q64JVSSIQ: 64M-bit Serial Flash Memory with uniform 4KB sectors and Dual/Quad SPI Source: Datasheet; ARROW_PART_NUMBER: W25Q64JVSSIQ; ARROW_PRICE-STOCK: https://www.arrow.com/en/products/w25q64jvssiq/winbond-electronics?region=nac; DESCRIPTION: 64M-bit Serial Flash Memory with uniform 4KB sectors and Dual/Quad SPI; HEIGHT: 2.16mm; MANUFACTURER_NAME: Winbond; MANUFACTURER_PART_NUMBER: W25Q64JVSSIQ; MOUSER_PART_NUMBER: 454-W25Q64JVSSIQ; MOUSER_PRICE-STOCK: https://www.mouser.co.uk/ProductDetail/Winbond/W25Q64JVSSIQ?qs=qSfuJ%252Bfl%2Fd4DecxlHDmB8w%3D%3D
IC3 = AP64501SP-13:AP64501SP-13: Conv DC-DC 3.8V to 40V Synchronous Step Down Single-Out 0.8V to 39V 5A 8-Pin SO EP T/R Source: Datasheet; ARROW_PART_NUMBER: AP64501SP-13; ARROW_PRICE-STOCK: https://www.arrow.com/en/products/ap64501sp-13/diodes-incorporated?region=nac; DESCRIPTION: Conv DC-DC 3.8V to 40V Synchronous Step Down Single-Out 0.8V to 39V 5A 8-Pin SO EP T/R; HEIGHT: 1.63mm; MANUFACTURER_NAME: Diodes Inc.; MANUFACTURER_PART_NUMBER: AP64501SP-13; MOUSER_PART_NUMBER: 621-AP64501SP-13; MOUSER_PRICE-STOCK: https://www.mouser.co.uk/ProductDetail/Diodes-Incorporated/AP64501SP-13?qs=P1JMDcb91o7FS0GU%252BW7TIQ%3D%3D
IN+ IN- = SparkFun-Connectors:TEST-POINT: SparkFun Test Points Bare copper test points for troubleshooting or In-Circuit-Testing. These are used by our Production team for verifying production board runs using pogo-pins on test beds. SparkFun Products: SparkFun LSM9DS1 Breakout <https://www.sparkfun.com/products/13284> SparkFun PSOC <https://www.sparkfun.com/products/13714> SparkFun Load Cell Amplifier <https://www.sparkfun.com/products/13879>
J1 = DX07S016JA1R1500:DX07S016JA1R1500: USB-C (USB TYPE-C) USB 2.0 Receptacle Connector 24 (16+8 Dummy) Position Surface Mount, Right Angle; Through Hole; DESCRIPTION: USB-C (USB TYPE-C) USB 2.0 Receptacle Connector 24 (16+8 Dummy) Position Surface Mount, Right Angle; Through Hole; DIGI-KEY_PART_NUMBER: 670-DX07S016JA1R1500CT-ND; MF: JAE Electronics; MP: DX07S016JA1R1500; PACKAGE: None; PURCHASE-URL: https://pricing.snapeda.com/search/part/DX07S016JA1R1500/?ref=eda
J2 = RP2040TR7:RP2040TR7: ARM MCU, RP2040 Series Microcontrollers, ARM Cortex-M0+, 32 bit, 133 MHz, 16 MB, 56 Pins Source: Datasheet; DESCRIPTION: ARM MCU, RP2040 Series Microcontrollers, ARM Cortex-M0+, 32 bit, 133 MHz, 16 MB, 56 Pins; HEIGHT: 0.9mm; MANUFACTURER_NAME: RASPBERRY-PI; MANUFACTURER_PART_NUMBER: RP2040TR7
J4 = SparkFun-Connectors:FTDI_DEVICE: Connector which mates to FTDI basic or FTDI cable.
J6 = EDCPSU:OLED_LCD
K1 = Flex_3mm:FLEX8: WR-FPC 1mm SMT Horiz. Bot. Contact Hinge type WR-FPC 1mm 08 pins Hinge type SMT Horizontal Bottom Contact ;=>Code : Con_FPC_ZIF_1.00_6861xx148922_686108148922 Details see: http://katalog.we-online.de/em/datasheet/6861xx148922.pdf Created 2014-10-08, Karrer Zheng 2014 (C) Wurth Elektronik
L1 = NRS4018T4R7MDGJ:NRS4018T4R7MDGJ: Inductor SMD wirewound 4.7uH Source: Datasheet; ARROW_PART_NUMBER: NRS4018T4R7MDGJ; ARROW_PRICE-STOCK: https://www.arrow.com/en/products/nrs4018t4r7mdgj/taiyo-yuden; DESCRIPTION: Inductor SMD wirewound 4.7uH; HEIGHT: 1mm; MANUFACTURER_NAME: TAIYO YUDEN; MANUFACTURER_PART_NUMBER: NRS4018T4R7MDGJ; MOUSER_PART_NUMBER: 963-NRS4018T4R7MDGJ; MOUSER_PRICE-STOCK: https://www.mouser.co.uk/ProductDetail/Taiyo-Yuden/NRS4018T4R7MDGJ?qs=PzICbMaShUfBUWy4ytltsA%3D%3D
L2 = EDCPSU - Rev3:L*
L3-L7 R1-R11 R13 R14 R16-R21 R23-R25 R27-R33 R35-R37 R39-R46 R52-R54 R57 R58 R61 R65 R66 R99 = SparkFun:RESISTOR: Resistor Basic schematic elements and footprints for 0603, 1206, and PTH resistors.
LED1 = SparkFun-LED:LED: LEDs Standard schematic elements and footprints for 5mm, 3mm, 1206, and 0603 sized LEDs. 5mm - Spark Fun Electronics SKU : COM-00529 (and others)
LS1 = SMT-0540-S-R:SMT-0540-S-R: Speakers & Transducers SMD TRANSDUCER 3VP-P 100MA Source: Datasheet; DESCRIPTION: Speakers & Transducers SMD TRANSDUCER 3VP-P 100MA; HEIGHT: 2mm; MANUFACTURER_NAME: PUI Audio; MANUFACTURER_PART_NUMBER: SMT-0540-S-R; MOUSER_PART_NUMBER: 665-SMT0540SR; MOUSER_PRICE-STOCK: https://www.mouser.co.uk/ProductDetail/PUI-Audio/SMT-0540-S-R?qs=e16JbV5WBEu5VaDVzQP23Q%3D%3D
OP1 = optocoupler:LTV816: OPTO COUPLER Source: LITEON, LTV816.pdf; OC_FARNELL: unknown; OC_NEWARK: unknown
PS1 = AP63201WU-7:AP63201WU-7: Switching Voltage Regulators DCDC Conv HV Buck TSOT26 T&R 3K Source: Datasheet; ARROW_PART_NUMBER: AP63201WU-7; ARROW_PRICE-STOCK: https://www.arrow.com/en/products/ap63201wu-7/diodes-incorporated?region=nac; DESCRIPTION: Switching Voltage Regulators DCDC Conv HV Buck TSOT26 T&R 3K; HEIGHT: 1mm; MANUFACTURER_NAME: Diodes Inc.; MANUFACTURER_PART_NUMBER: AP63201WU-7; MOUSER_PART_NUMBER: 621-AP63201WU-7; MOUSER_PRICE-STOCK: https://www.mouser.co.uk/ProductDetail/Diodes-Incorporated/AP63201WU-7?qs=u16ybLDytRaVD%252BU3eG30NA%3D%3D
PTC1 = EDCPSU:PTC-: Positive Temperature Coefficient Resistor (PTC) PTC Littlefuse 1812L200THPR - Resetteable Fuse 3.5A.pdf
Q1 = PJA3416AE_R1_00001:PJA3416AE_R1_00001; COPYRIGHT: Copyright (C) 2022 Ultra Librarian. All rights reserved.; DIGI-KEY_PART_NUMBER_1: 3757-PJA3416AE_R1_00001TR-ND; DIGI-KEY_PART_NUMBER_2: 3757-PJA3416AE_R1_00001CT-ND; DIGI-KEY_PART_NUMBER_3: 3757-PJA3416AE_R1_00001DKR-ND; MANUFACTURER_PART_NUMBER: PJA3416AE_R1_00001; MFR_NAME: Panjit
Q2 Q4 Q5 = SparkFun-DiscreteSemi:MOSFET-NCHANNEL: Common NMOSFET Parts MFG P/N Store ID Prod ID FDD8780 TRANS-09984 SI7820DN TRANS-11055 FDS6630A IC-08089 2N7002PW TRANS-11151 FQP30N06L COM-10213 TRANS-10060 BSS123LT1G TRANS-08345 BSS138 TRANS-00830 BS170 2N7000; PROD_ID: TRANS-11151
R12 = eagle-ltspice:R: RESISTOR, European symbol; SPICEMODEL: NONE; SPICEPREFIX: R
R15 R34 R38 R47-R51 R55 R56 R59 R62 RSENSE = SparkFun-Resistors:RESISTOR: Generic Resistor Package
R22 R26 = SparkFun-Passives:RESISTOR: Resistor Basic schematic elements and footprints for 0603, 1206, and PTH resistors.
S1 = SparkFun-Electromechanical:ROTARTY_ENCODER: Simple no LED rotary encoder Example: COM-09117
S2 = EDCPSU - Rev2:TAC_SWITCH: Momentary Switch Button commonly used for reset or general input. Spark Fun Electronics SKU : COM-00097 SMT- SWCH-08247
TP1-TP7 TP9-TP12 TP14 = SparkFun-Connectors:M01: Header 1 Standard 1-pin 0.1" header. Use with straight break away headers (SKU : PRT-00116), right angle break away headers (PRT-00553), swiss pins (PRT-00743), machine pins (PRT-00117), and female headers (PRT-00115).
U1 = SparkFun-IC-Conversion:MCP4725: MCP4725 DAC Microchip 12-bit I2C DAC, SOT23-6 Datasheet SparkFun Products SparkFun I2C DAC Breakout - MCP4725 (BOB-12918); PROD_ID: IC-08886
U3 U6 = 74xx-eu:74*14: Hex schmitt trigger INVERTER
U4 = MAX9938:MAX9938FEUK+T; DESCRIPTION: Precision Current-Sense Amplifier; MPN: MAX9938FEUK+T; OC_FARNELL: -; OC_NEWARK: 01N6733; PACKAGE: SOT-23-5; SUPPLIER: Maxim
U7 = EDCPSU - Rev2:TPIC2810D
U9 = MAX9064:MAX9064EUK+T; COPYRIGHT: Copyright (C) 2022 Ultra Librarian. All rights reserved.; DIGI-KEY_PART_NUMBER_1: MAX9064EUK+TCT-ND; DIGI-KEY_PART_NUMBER_2: MAX9064EUK+TDKR-ND; DIGI-KEY_PART_NUMBER_3: MAX9064EUK+TTR-ND; MANUFACTURER_PART_NUMBER: MAX9064EUK+T; MFR_NAME: Maxim Integrated Products
U10 = IP2721:IP2721: TYPEC/PD2.0/PD3.0 Physical Layer IC for USB TYPEC input Interfaces Working voltage: 3V~25V Package: TSSOP16 Source: Datasheet; DESCRIPTION: TYPEC/PD2.0/PD3.0 Physical Layer IC for USB TYPEC input Interfaces Working voltage: 3V~25V Package: TSSOP16; HEIGHT: 1.2mm; MANUFACTURER_NAME: INJOINIC; MANUFACTURER_PART_NUMBER: IP2721
Y1 = ABLS-12.000MHZ-B4-T:ABLS-12.000MHZ-B4-T: ABRACON - ABLS-12.000MHZ-B4-T - CRYSTAL, 12MHZ, 18PF, HC-49US Source: Datasheet; ARROW_PART_NUMBER: ABLS-12.000MHZ-B4-T; ARROW_PRICE-STOCK: https://www.arrow.com/en/products/abls-12.000mhz-b4-t/abracon?region=nac; DESCRIPTION: ABRACON - ABLS-12.000MHZ-B4-T - CRYSTAL, 12MHZ, 18PF, HC-49US; HEIGHT: mm; MANUFACTURER_NAME: ABRACON; MANUFACTURER_PART_NUMBER: ABLS-12.000MHZ-B4-T; MOUSER_PART_NUMBER: 815-ABLS-12.0M-T; MOUSER_PRICE-STOCK: https://www.mouser.co.uk/ProductDetail/ABRACON/ABLS-12.000MHZ-B4-T?qs=yTU0IcKoRlGSQ8ooxPPVnQ%3D%3D

## Net classes
1 vcc: width 0.254 mm